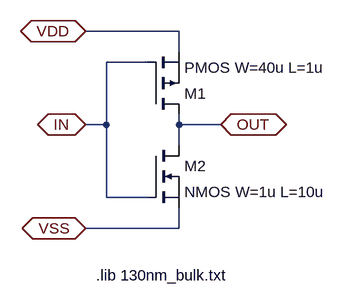
[diagram p0: schematic skewH_inverter.asc]
skewH_inverter.asc, the LTspice schematic file:
Version 4
SHEET 1 880 680
WIRE 128 -48 -16 -48
WIRE 128 -16 128 -48
WIRE 80 0 16 0
WIRE 16 96 16 0
WIRE 16 96 -16 96
WIRE 128 96 128 80
WIRE 192 96 128 96
WIRE 128 128 128 96
WIRE 16 208 16 96
WIRE 80 208 16 208
WIRE 128 256 128 224
WIRE 128 256 -16 256
FLAG 192 96 OUT
IOPIN 192 96 BiDir
FLAG -16 -48 VDD
IOPIN -16 -48 BiDir
FLAG -16 96 IN
IOPIN -16 96 BiDir
FLAG -16 256 VSS
IOPIN -16 256 BiDir
SYMBOL pmos 80 80 M180
SYMATTR InstName M1
SYMATTR Value PMOS W=40u L=1u
SYMBOL nmos 80 128 R0
SYMATTR InstName M2
SYMATTR Value NMOS W=1u L=10u
TEXT 0 328 Left 2 !.lib 130nm_bulk.txt

The netlist it stands for:
* skewH_inverter.asc
M1 OUT IN VDD VDD PMOS W=40u L=1u
M2 OUT IN VSS VSS NMOS W=1u L=10u
.model NMOS NMOS
.model PMOS PMOS
.lib standard.mos
.lib 130nm_bulk.txt
.backanno
.end